# Altium schematic sheet MCU063A_Emulator_interface.SchDoc
size 431 x 279 mm; Date: Not shown in title block; ApprovedBy: Not shown in title block; CheckedBy: Not shown in title block; Author: Not shown in title block; CompanyName: Not shown in title block; DrawnBy: Cody Watkins; Engineer: Not shown in title block; Organization: Not shown in title block; Address1: Not shown in title block; Address2: Not shown in title block; Address3: Not shown in title block; Address4: Not shown in title block; DocumentNumber: 10; Revision: Use project parameter SCH_Rev; SheetNumber: 10; SheetTotal: 11; PageSetup: Record=PageOptions|CenterHorizontal=True|CenterVertical=True|PrintScale=1.00|XCorrection=1.00|YCorrection=1.00|PrintKind=0|BorderSize=5000000|LeftOffset=0|BottomOffset=0|Orientation=2|PaperLength=1000|PaperWidth=1000|Scale=100|PaperSource=15|PrintQuality=600|MediaType=1|DitherType=10|PaperKind=Letter|PrintScaleMode=1; CurrentTime: Not shown in title block; CurrentDate: Not shown in title block; Time: Not shown in title block; DocumentFullPathAndName: Not shown in title block; DocumentName: Not shown in title block; ModifiedDate: Not shown in title block; ImagePath: Not shown in title block
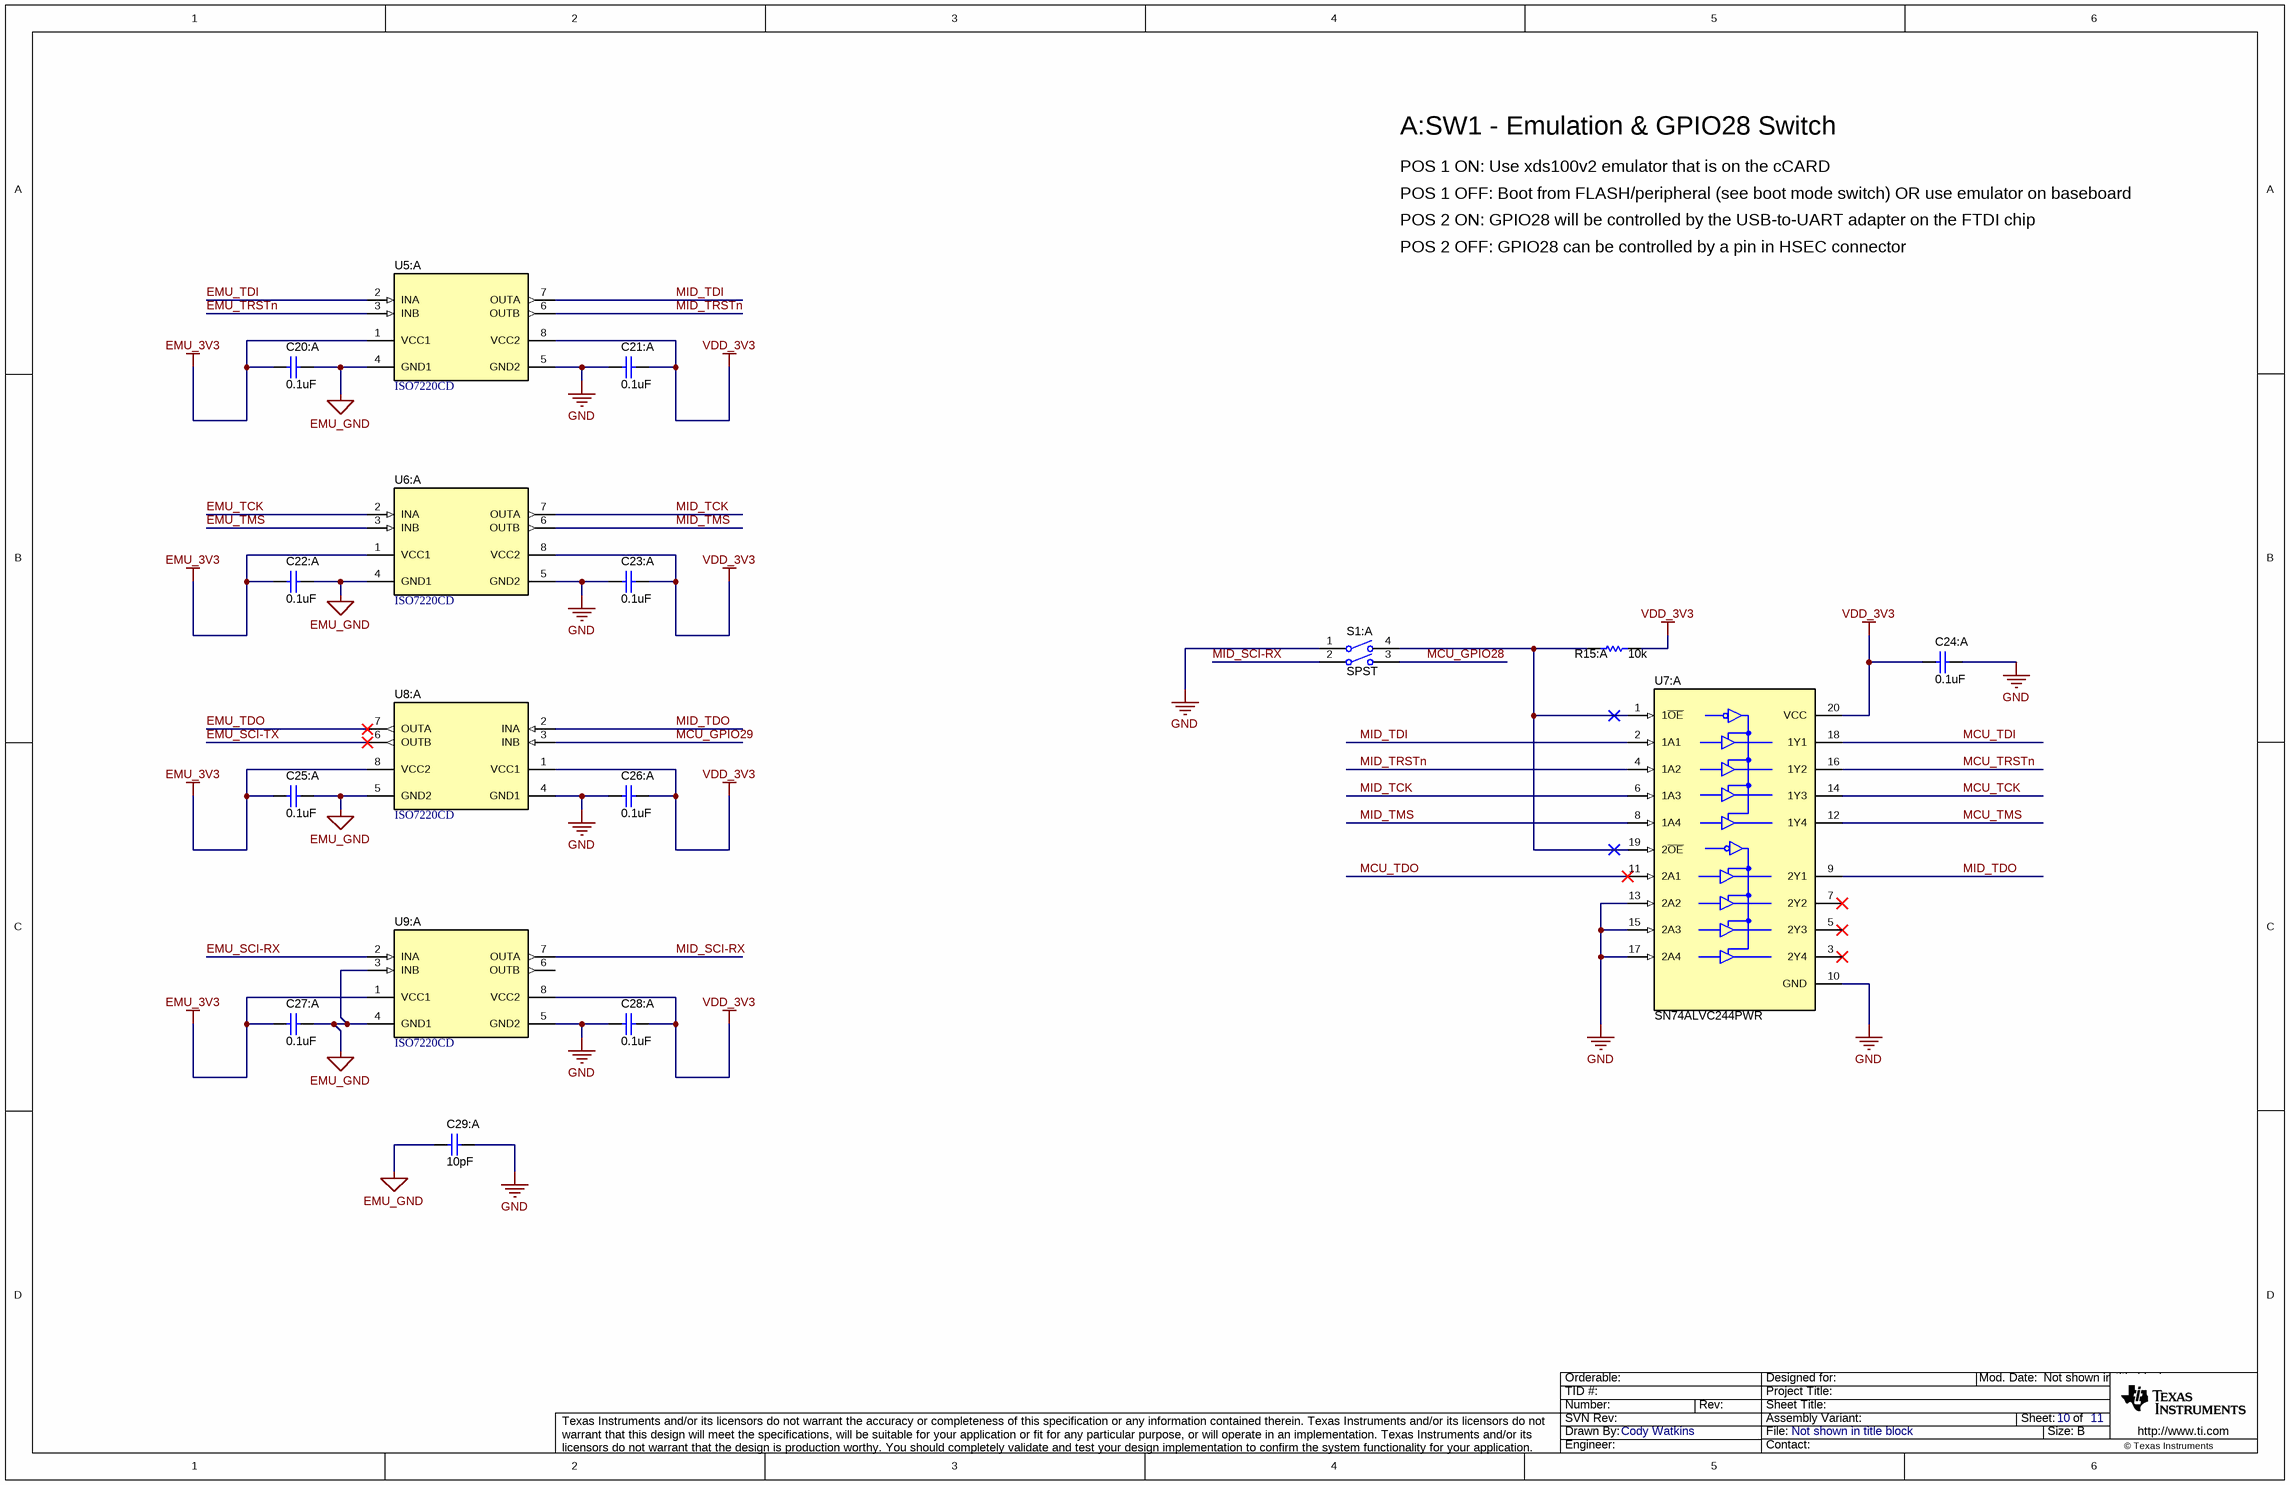
[diagram p0: MCU063A_Emulator_interface.SchDoc]

## Parts
C20:A  ValueDisplayed: 0.1uF  [0402]  (hidden comment: CL05B104KP5NNNC)
C21:A  ValueDisplayed: 0.1uF  [0402]  (hidden comment: CL05B104KP5NNNC)
C22:A  ValueDisplayed: 0.1uF  [0402]  (hidden comment: CL05B104KP5NNNC)
C23:A  ValueDisplayed: 0.1uF  [0402]  (hidden comment: CL05B104KP5NNNC)
C24:A  ValueDisplayed: 0.1uF  [0402]  (hidden comment: CL05B104KP5NNNC)
C25:A  ValueDisplayed: 0.1uF  [0402]  (hidden comment: CL05B104KP5NNNC)
C26:A  ValueDisplayed: 0.1uF  [0402]  (hidden comment: CL05B104KP5NNNC)
C27:A  ValueDisplayed: 0.1uF  [0402]  (hidden comment: CL05B104KP5NNNC)
C28:A  ValueDisplayed: 0.1uF  [0402]  (hidden comment: CL05B104KP5NNNC)
C29:A  ValueDisplayed: 10pF  [1812_180]  (hidden comment: C1812C100JHGACTU)
R15:A  ValueDisplayed: 10k  [0402]  (hidden comment: CRCW040210K0JNED)
S1:A  Circuit: SPST  [SW_218-2LP]  (hidden comment: 218-2LPST)
U5:A  ISO7220CD  [D0008B_N]
U6:A  ISO7220CD  [D0008B_N]
U7:A  SN74ALVC244PWR  [PW0020A_N]
U8:A  ISO7220CD  [D0008B_N]
U9:A  ISO7220CD  [D0008B_N]

## Nets
EMU_3V3: C20:A.2 C22:A.2 C25:A.2 C27:A.2 U5:A.1(VCC1) U6:A.1(VCC1) U8:A.8(VCC2) U9:A.1(VCC1)
EMU_GND: C20:A.1 C22:A.1 C25:A.1 C27:A.1 C29:A.2 U5:A.4(GND1) U6:A.4(GND1) U8:A.5(GND2) U9:A.3(INB) U9:A.4(GND1)
GND: C21:A.2 C23:A.2 C24:A.1 C26:A.2 C28:A.2 C29:A.1 S1:A.1 U5:A.5(GND2) U6:A.5(GND2) U7:A.10(GND) U7:A.13(2A2) U7:A.15(2A3) U7:A.17(2A4) U8:A.4(GND1) U9:A.5(GND2)
VDD_3V3: C21:A.1 C23:A.1 C24:A.2 C26:A.1 C28:A.1 R15:A.2 U5:A.8(VCC2) U6:A.8(VCC2) U7:A.20(VCC) U8:A.1(VCC1) U9:A.8(VCC2)
EMU_SCI-RX: U9:A.2(INA)
EMU_SCI-TX: U8:A.6(OUTB)
EMU_TCK: U6:A.2(INA)
EMU_TDI: U5:A.2(INA)
EMU_TDO: U8:A.7(OUTA)
EMU_TMS: U6:A.3(INB)
EMU_TRSTn: U5:A.3(INB)
MCU_GPIO28: S1:A.3
MCU_GPIO29: U8:A.3(INB)
MCU_TCK: U7:A.14(1Y3)
MCU_TDI: U7:A.18(1Y1)
MCU_TDO: U7:A.11(2A1)
MCU_TMS: U7:A.12(1Y4)
MCU_TRSTn: U7:A.16(1Y2)
MID_SCI-RX: S1:A.2 U9:A.7(OUTA)
MID_TCK: U6:A.7(OUTA) U7:A.6(1A3)
MID_TDI: U5:A.7(OUTA) U7:A.2(1A1)
MID_TDO: U7:A.9(2Y1) U8:A.2(INA)
MID_TMS: U6:A.6(OUTB) U7:A.8(1A4)
MID_TRSTn: U5:A.6(OUTB) U7:A.4(1A2)
NetR15:A_1: R15:A.1 S1:A.4 U7:A.1(1~{OE}) U7:A.19(2~{OE})

Not connected (* = marked no-connect by the designer): U7:A 3(2Y4)* 5(2Y3)* 7(2Y2)*; U9:A 6(OUTB)

## Notes on the sheet
- A:SW1 - Emulation & GPIO28 Switch
- POS 1 ON: Use xds100v2 emulator that is on the cCARD
- POS 1 OFF: Boot from FLASH/peripheral (see boot mode switch) OR use emulator on baseboard
- POS 2 ON: GPIO28 will be controlled by the USB-to-UART adapter on the FTDI chip
- POS 2 OFF: GPIO28 can be controlled by a pin in HSEC connector
- Drawn By:
- SVN Rev:
- Number:
- TID #:
- Orderable:
- Rev:
- Sheet Title:
- File:
- Project Title:
- Designed for:
- Assembly Variant:
- Mod. Date:
- Sheet:
- Size:
- of
- B
- http://www.ti.com
- Texas Instruments and/or its licensors do not warrant the accuracy or completeness of this specification or any information contained therein. Texas Instruments and/or its licensors do not warrant that this design will meet the specifications, will be suitable for your application or fit for any particular purpose, or will operate in an implementation. Texas Instruments and/or its licensors do not warrant that the design is production worthy. You should completely validate and test your design implementation to confirm the system functionality for your application.
- Engineer:
- Contact:
- © Texas Instruments

## Library data of the parts
C20:A C21:A C22:A C23:A C24:A C25:A C26:A C27:A C28:A = CMP-0006343-2: CAP, CERM, 0.1 uF, 10 V, +/- 10%, X7R, 0402; Manufacturer: Samsung Electro-Mechanics; Polarized: N; Value: 0.1uF; U/M: EA; Cap_F: 100nF; Value1: Unknown; VDC_V: 10V; TaMin_C: -55°C; TaMax_C: 125°C; AEC Category: Q200; SizeArea_mm2: 0.5; SizeAreaWB_mm2: 3; SizeX_mm: 1; SizeZ_mm: 0.6; CompType: Capacitor; PartNumber: CL05B104KP5NNNC; PackageReference: 0402; RoHS: Y; Tolerance_%: 10%; Value2: 10V; MountType: SMT; Technology: Ceramic; TempCo: X7R; Cap_Case: 0402; Published: 2008-06-19; Publisher: Texas Instruments; LatestRevisionDate: 2017-03-09; ComponentLink1Description: Datasheet link; ComponentLink1URL: http://www.samsungsem.com/kr/front/downloadcms.do?path=/kr/support/product-search/mlcc/__icsFiles/afieldfile/2014/11/05&fileName=S_CL05B104KP5NNNC.pdf; AEC Qualified: N; AEC Grade: N/A; SizeY_mm: 0.5
C29:A = CMP-0082066-1: CAP, CERM, 10 pF, 3000 V,+/- 5%, C0G/NP0, AEC-Q200 Grade 1, 1812; Manufacturer: Kemet; SizeAreaWB_mm2: 23.1; SizeArea_mm2: 14.4; AEC Qualified: Y; AEC Category: Q200; Value: 10pF; TaMax_C: 125°C; SizeZ_mm: 1.8; AEC Grade: 1; Polarized: N; TaMin_C: -55°C; SizeY_mm: 3.2; Value2: 3000V; U/M: EA; SizeX_mm: 4.5; Cap_Case: 1812; ComponentLink1Description: Datasheet link; Cap_F: 10pF; RoHS: Y; Tolerance_%: 5%; Supplier 1: Digi-Key; PackageReference: 1812; Technology: Ceramic; PartNumber: C1812C100JHGACTU; TempCo: C0G/NP0; Supplier Part Number 2: 80-C1812C100JHG; Supplier 2: Mouser; ComponentLink1URL: https://search.kemet.com/component-edge/download/datasheet/C1812C100JHGACTU.pdf; CompType: Capacitor; MountType: SMT; Supplier Part Number 1: 399-7113-1-ND
R15:A = CMP-0026825-5: RES, 10 k, 5%, 0.063 W, AEC-Q200 Grade 0, 0402; Manufacturer: Vishay-Dale; Value: 10k; Value_Code: 10k0; Power_W: 63mW; Value2: 0.063W; VDC_V: 50V; TempCo: 200 ppm/C; EIA_Code: E24; AEC Category: Q200; AEC Qualified: Y; AEC Grade: 0; SizeArea_mm2: 0.5; SizeX_mm: 1; SizeZ_mm: 0.6; CompType: Resistor; PartNumber: CRCW040210K0JNED; PackageReference: 0402; RoHS: E; Res_ohm: 10k; Tolerance_%: 5%; Value1: 5%; MountType: SMT; Technology: Thick Film; ComponentLink1Description: Datasheet link; ComponentLink1URL: http://www.vishay.com/docs/20035/dcrcwe3.pdf; Supplier 1: Digi-Key; Supplier Part Number 1: 541-10KJCT-ND; Supplier 2: Newark; Supplier Part Number 2: 59M6696; Supplier 3: Mouser; Supplier Part Number 3: 71-CRCW0402J-10K-E3; SizeY_mm: 0.5
S1:A = CMP-0002230-1: Switch, SPST, 2 Pos, 25mA, 24VDC, SMD; Manufacturer: CTS Electrocomponents; VDC_V: 24V; SwitchFunction: Off-On; PositionCount: 2; CurrentRating_mA: 25A; PartNumber: 218-2LPST; MountType: SMT; ComponentLink1Description: Datasheet Link; ComponentLink1URL: http://www.ctscorp.com/components/Datasheets/218.pdf; RoHS: Y; Orientation: Top Actuated; CompType: Switch; PackageReference: 3.71x5.8mm; Publisher: Texas Instruments; LatestRevisionDate: 2017-03-09; Supplier 1: Digi-Key; Supplier Part Number 1: CT2182LPST-ND; Supplier 2: Mouser; Supplier Part Number 2: 774-2182LPST
U5:A U6:A U8:A U9:A = CMP-0029375-1: 25 Mbps Dual Channels, 2 / 0, Digital Isolator, 3.3 V / 5 V, -40 to +125 degC, 8-pin SOIC (D), Green (RoHS & no Sb/Br); Manufacturer: Texas Instruments; Datarate(Mbps): 25; Input Noise Filter: Yes; Insulation Rating(VRMS): 2500; Prop Delay(Max)(ns): 42; Rating: Catalog; Supply Voltage(s)(V): 3.3, 5; TTL/CMOS Input Threshold: TTL; DatasheetVersion: SLLS755L; PackageVersion: revM, Jun-2011; PackageReference: D0008B; PackageDescription: 8-Pin Plastic Small Outline Integrated Circuit, 4.9 x 3.9 mm, Pitch 1.27 mm Pitch; Eco-Plan: Green (RoHS & no Sb/Br); SubFamily: Isolator; Thermal Shutdown: No; PartNumber: ISO7220CD; ComponentLink1Description: Manufacturer URL; ComponentLink1URL: http://www.ti.com/; ComponentLink2Description: Datasheet; ComponentLink2URL: http://www.ti.com/general/docs/lit/getliterature.tsp?genericPartNumber=ISO7220C&fileType=pdf; ComponentLink3Description: URL Link1; ComponentLink3URL: SamplesURL:http://www.ti.com/product/iso7220c#samples; Channel Configuration: 2/01/2000; Mounting Technology: Surface Mount
U7:A = CMP-0047070-3: Octal Buffer/Driver With 3-State OUtputs, PW0020A (TSSOP-20); Manufacturer: Texas Instruments; Bits(#): 8; F @ Nom Voltage(Max)(Mhz): 100; ICC @ Nom Voltage(Max)(mA): 0.024; Input Type: LVTTL; Rating: Catalog; tpd @ Nom Voltage(Max)(ns): 4.4,3.1,2.8; VCC(Max)(V): 3.6; VCC(Min)(V): 1.65; Voltage(Nom)(V): 1.8,2.5,2.7,3.3; AEC Category: Q200; AEC Qualified: N; CompType: IC; SizeArea_mm2: 43.56; SizeAreaWB_mm2: 73.96; SizeX_mm: 6.6; SizeZ_mm: 1.2; PackageReference: PW0020A; Code_JEDEC: MO-153; DatasheetVersion: SCES188G; Generic Part Number: SN74ALVC244; Operating Temperature Range(C): -40 to 85; Output Type: LVTTL; PackageVersion: http://www.ti.com/lit/ml/mpds362/mpds362.pdf; Alternate Manufacturer: Texas Instruments; Alternate PartNumber: SN74ALVC244PW; ComponentLink1Description: Datasheet Link; ComponentLink1URL: http://www.ti.com/lit/ds/symlink/sn74alvc244.pdf; ComponentLink2Description: Product Folder; ComponentLink2URL: http://www.ti.com/product/sn74alvc244; ComponentLink3Description: Online Datasheet; ComponentLink3URL: http://www.ti.com/product/sn74alvc244/datasheet; MountType: SMT; PackageDescription: TSSOP-20; PartNumber: SN74ALVC244PWR; RoHS: Y; SizeY_mm: 6.6